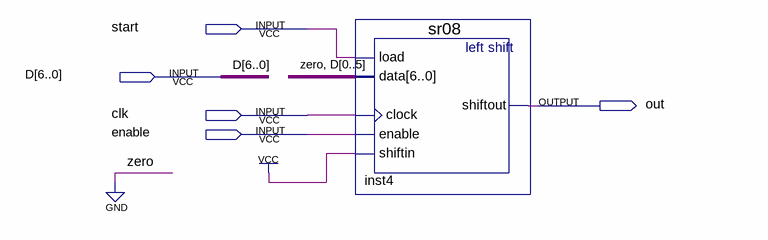
[diagram p0: schematic sheet]
// Quartus schematic b8.bdf as structural Verilog: 1 symbols, 5 pins
module b8 (
  input  start,
  input  [6:0] D,
  input  clk,
  input  enable,
  output out
);

  sr08 inst4 (
    .load(start), .data({1'b0, D[0], D[1], D[2], D[3], D[4], D[5]}), .clock(clk), .enable(enable),
    .shiftin(1'b1), .shiftout(out));
endmodule
